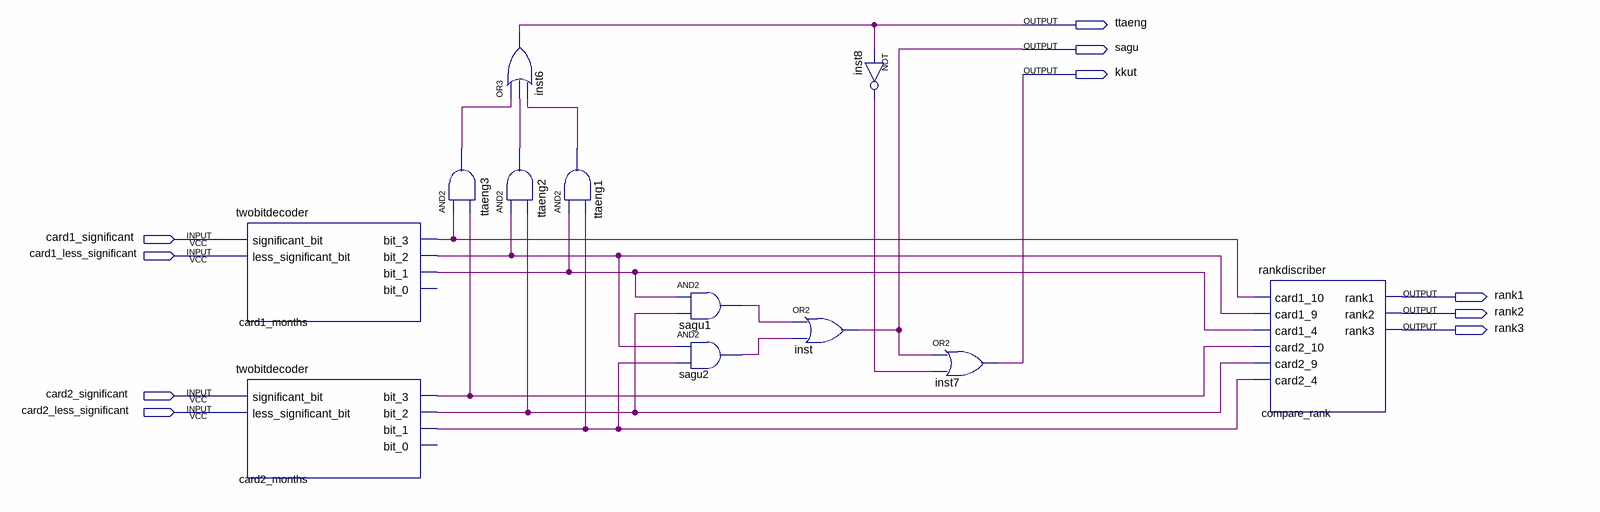
[diagram p0: schematic sheet]
// Quartus schematic playercarddecoder.bdf as structural Verilog: 12 symbols, 10 pins
module playercarddecoder (
  input  card1_significant,
  input  card1_less_significant,
  input  card2_significant,
  input  card2_less_significant,
  output ttaeng,
  output sagu,
  output kkut,
  output rank1,
  output rank2,
  output rank3
);

  wire card1_months_bit_1, card1_months_bit_2, card1_months_bit_3, card2_months_bit_1, card2_months_bit_2,
       card2_months_bit_3, inst8_out, sagu1_out, sagu2_out, ttaeng1_out, ttaeng2_out, ttaeng3_out;

  twobitdecoder card1_months (
    .significant_bit(card1_significant), .less_significant_bit(card1_less_significant),
    .bit_3(card1_months_bit_3), .bit_2(card1_months_bit_2), .bit_1(card1_months_bit_1));  // open: bit_0
  twobitdecoder card2_months (
    .significant_bit(card2_significant), .less_significant_bit(card2_less_significant),
    .bit_3(card2_months_bit_3), .bit_2(card2_months_bit_2), .bit_1(card2_months_bit_1));  // open: bit_0
  and ttaeng3 (ttaeng3_out, card1_months_bit_3, card2_months_bit_3);
  or inst6 (ttaeng, ttaeng3_out, ttaeng2_out, ttaeng1_out);
  and ttaeng2 (ttaeng2_out, card1_months_bit_2, card2_months_bit_2);
  and ttaeng1 (ttaeng1_out, card1_months_bit_1, card2_months_bit_1);
  and sagu1 (sagu1_out, card1_months_bit_1, card2_months_bit_2);
  and sagu2 (sagu2_out, card1_months_bit_2, card2_months_bit_1);
  or inst (sagu, sagu1_out, sagu2_out);
  not inst8 (inst8_out, ttaeng);
  or inst7 (kkut, sagu, inst8_out);
  rankdiscriber compare_rank (
    .card1_10(card1_months_bit_3), .card1_9(card1_months_bit_2), .card1_4(card1_months_bit_1),
    .card2_10(card2_months_bit_3), .card2_9(card2_months_bit_2), .card2_4(card2_months_bit_1), .rank1(rank1),
    .rank2(rank2), .rank3(rank3));
endmodule
